# EAGLE schematic pj13_duplicate (EAGLE 7.3.2)
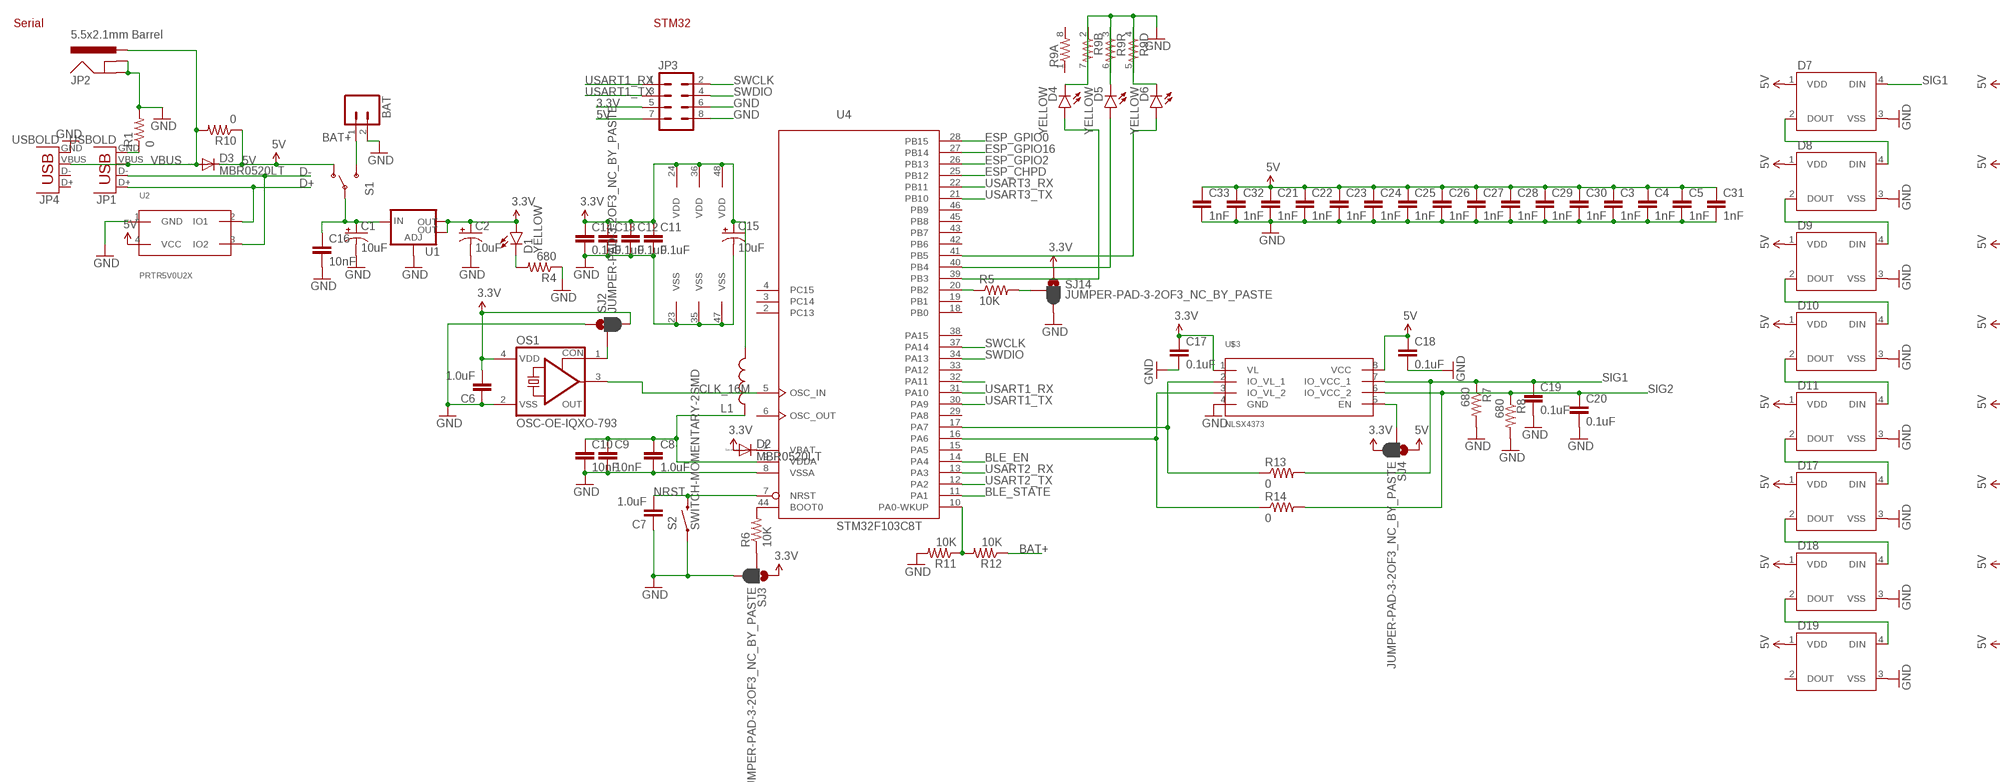
[diagram p0: schematic, sheet 1, part 1 of 2]
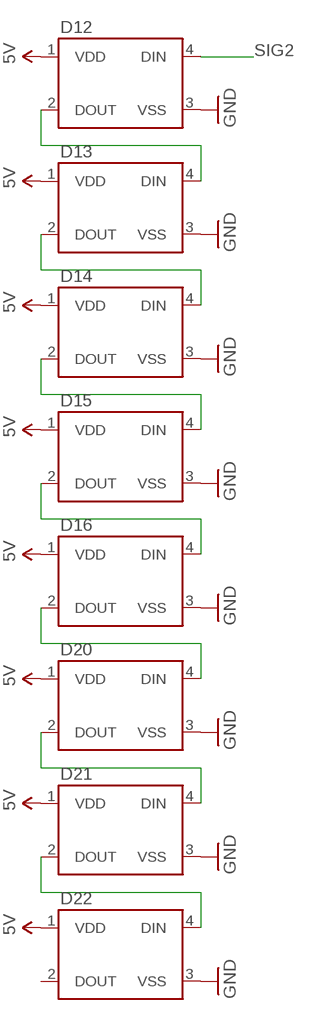
[diagram p1: schematic, sheet 1, part 2 of 2]

## Parts
BAT  M02LOCK  [1X02_LOCK]
C1  10uF  10UF-16V-10%(TANT)  [EIA3216]
C2  10uF  10UF-16V-10%(TANT)  [EIA3216]
C3  1nF  0.1UF-25V-5%(0603)  [0603-CAP]
C4  1nF  0.1UF-25V-5%(0603)  [0603-CAP]
C5  1nF  0.1UF-25V-5%(0603)  [0603-CAP]
C6  1.0uF  1.0UF-16V-10%(0603)  [0603-CAP]
C7  1.0uF  1.0UF-16V-10%(0603)  [0603-CAP]
C8  1.0uF  1.0UF-16V-10%(0603)  [0603-CAP]
C9  10nF  10NF/10000PF-50V-10%(0603)  [0603-CAP]
C10  10nF  10NF/10000PF-50V-10%(0603)  [0603-CAP]
C11  0.1uF  0.1UF-25V-5%(0603)  [0603-CAP]
C12  0.1uF  0.1UF-25V-5%(0603)  [0603-CAP]
C13  0.1uF  0.1UF-25V-5%(0603)  [0603-CAP]
C14  0.1uF  0.1UF-25V-5%(0603)  [0603-CAP]
C15  10uF  10UF-16V-10%(TANT)  [EIA3216]
C16  10nF  10NF/10000PF-50V-10%(0603)  [0603-CAP]
C17  0.1uF  0.1UF-25V-5%(0603)  [0603-CAP]
C18  0.1uF  0.1UF-25V-5%(0603)  [0603-CAP]
C19  0.1uF  0.1UF-25V-5%(0603)  [0603-CAP]
C20  0.1uF  0.1UF-25V-5%(0603)  [0603-CAP]
C21  1nF  0.1UF-25V-5%(0603)  [0603-CAP]
C22  1nF  0.1UF-25V-5%(0603)  [0603-CAP]
C23  1nF  0.1UF-25V-5%(0603)  [0603-CAP]
C24  1nF  0.1UF-25V-5%(0603)  [0603-CAP]
C25  1nF  0.1UF-25V-5%(0603)  [0603-CAP]
C26  1nF  0.1UF-25V-5%(0603)  [0603-CAP]
C27  1nF  0.1UF-25V-5%(0603)  [0603-CAP]
C28  1nF  0.1UF-25V-5%(0603)  [0603-CAP]
C29  1nF  0.1UF-25V-5%(0603)  [0603-CAP]
C30  1nF  0.1UF-25V-5%(0603)  [0603-CAP]
C31  1nF  0.1UF-25V-5%(0603)  [0603-CAP]
C32  1nF  0.1UF-25V-5%(0603)  [0603-CAP]
C33  1nF  0.1UF-25V-5%(0603)  [0603-CAP]
D1  YELLOW  LED-YELLOW1206  [LED-1206]
D2  MBR0520LT  [SOD123]
D3  MBR0520LT  [SOD123]
D4  YELLOW  LED-YELLOW1206  [LED-1206]
D5  YELLOW  LED-YELLOW1206  [LED-1206]
D6  YELLOW  LED-YELLOW1206  [LED-1206]
D7  WS2812B  [WS2812B]
D8  WS2812B  [WS2812B]
D9  WS2812B  [WS2812B]
D10  WS2812B  [WS2812B]
D11  WS2812B  [WS2812B]
D12  WS2812B  [WS2812B]
D13  WS2812B  [WS2812B]
D14  WS2812B  [WS2812B]
D15  WS2812B  [WS2812B]
D16  WS2812B  [WS2812B]
D17  WS2812B  [WS2812B]
D18  WS2812B  [WS2812B]
D19  WS2812B  [WS2812B]
D20  WS2812B  [WS2812B]
D21  WS2812B  [WS2812B]
D22  WS2812B  [WS2812B]
JP1  USBOLD  [USB-MINIB-OLD]
JP2  5.5x2.1mm Barrel  POWER_JACKSMD  [POWER_JACK_SMD]
JP3  M04X2SMD  [2X4_SMD]
JP4  USBOLD  [USB-MINIB-OLD]
L1  INDUCTOR0603  [0603]
OS1  OSC-OE-IQXO-793  [2.5X2-4-PAD]
R1  0  0OHM-1/10W-5%(0603)  [0603]
R4  680  680OHM1/10W5%(0603)  [0603-RES]
R5  10K  10KOHM-1/10W-1%(0603)0603  [0603-RES]
R6  10K  10KOHM-1/10W-1%(0603)0603  [0603-RES]
R7  680  680OHM1/10W5%(0603)  [0603-RES]
R8  680  680OHM1/10W5%(0603)  [0603-RES]
R9  RESISTOR-ARRAY0603-ARV  [0603-ARV]
R10  0  0OHM-1/10W-5%(0603)  [0603]
R11  10K  10KOHM-1/10W-1%(0603)0603  [0603-RES]
R12  10K  10KOHM-1/10W-1%(0603)0603  [0603-RES]
R13  0  680OHM1/10W5%(0603)  [0603-RES]
R14  0  680OHM1/10W5%(0603)  [0603-RES]
S1  SWITCH-SPDTSMD  [AYZ0202]
S2  SWITCH-MOMENTARY-2SMD  [TACTILE-SWITCH-SMD]
SJ2  JUMPER-PAD-3-2OF3_NC_BY_PASTE  [PAD-JUMPER-3-2OF3_NC_BY_PASTE_YES_SILK_FULL_BOX]
SJ3  JUMPER-PAD-3-2OF3_NC_BY_PASTE  [PAD-JUMPER-3-2OF3_NC_BY_PASTE_YES_SILK_FULL_BOX]
SJ4  JUMPER-PAD-3-2OF3_NC_BY_PASTE  [PAD-JUMPER-3-2OF3_NC_BY_PASTE_YES_SILK_FULL_BOX]
SJ14  JUMPER-PAD-3-2OF3_NC_BY_PASTE  [PAD-JUMPER-3-2OF3_NC_BY_PASTE_YES_SILK_FULL_BOX]
U1  V_REG_LM1117SOT223  [SOT223]
U2  PRTR5V0U2X  [SOT143]
U4  STM32F103C8T  [LQFP48]
U$3  NLSX4373  [SO08]

## Nets
3.3V: C2.A(+) C6.2 C11.1 C12.1 C13.1 C14.1 C15.A(+) C17.1 D1.A D2.A JP3.5 L1.2 OS1.4(VDD) SJ2.3 SJ3.1 SJ4.3 SJ14.1 U1.2(OUT) U1.4(OUT) U4.24(VDD) U4.36(VDD) U4.48(VDD) U$3.1(VL)
5V: C3.1 C4.1 C5.1 C18.1 C21.1 C22.1 C23.1 C24.1 C25.1 C26.1 C27.1 C28.1 C29.1 C30.1 C31.1 C32.1 C33.1 D3.C D7.1(VDD) D8.1(VDD) D9.1(VDD) D10.1(VDD) D11.1(VDD) D12.1(VDD) D13.1(VDD) D14.1(VDD) D15.1(VDD) D16.1(VDD) D17.1(VDD) D18.1(VDD) D19.1(VDD) D20.1(VDD) D21.1(VDD) D22.1(VDD) JP3.7 R10.1 S1.1(O) SJ4.1 U2.4(VCC) U$3.8(VCC)
BAT+: BAT.1 R12.1 S1.3(S)
BLE_EN: U4.14(PA4)
BLE_STATE: U4.11(PA1)
CLK_16M: OS1.3(OUT) U4.5(OSC_IN)
D+: JP1.D+ U2.2(IO1)
D-: JP1.D- U2.3(IO2)
ESP_CHPD: U4.25(PB12)
ESP_GPIO0: U4.28(PB15)
ESP_GPIO2: U4.26(PB13)
ESP_GPIO16: U4.27(PB14)
GND: BAT.2 C1.C(-) C2.C(-) C3.2 C4.2 C5.2 C6.1 C7.1 C8.2 C9.2 C10.2 C11.2 C12.2 C13.2 C14.2 C15.C(-) C16.2 C17.2 C18.2 C19.2 C20.2 C21.2 C22.2 C23.2 C24.2 C25.2 C26.2 C27.2 C28.2 C29.2 C30.2 C31.2 C32.2 C33.2 D7.3(VSS) D8.3(VSS) D9.3(VSS) D10.3(VSS) D11.3(VSS) D12.3(VSS) D13.3(VSS) D14.3(VSS) D15.3(VSS) D16.3(VSS) D17.3(VSS) D18.3(VSS) D19.3(VSS) D20.3(VSS) D21.3(VSS) D22.3(VSS) JP2.GND(GNDBREAK) JP2.P$4(GND) JP3.6 JP3.8 JP4.GND OS1.2(VSS) R1.2 R4.1 R7.2 R8.2 R9.5 R9.6 R9.7 R11.2 S2.1 SJ2.1 SJ3.3 SJ14.3 U1.1(ADJ) U2.1(GND) U4.8(VSSA) U4.23(VSS) U4.35(VSS) U4.47(VSS) U$3.4(GND)
N$1: JP1.GND R1.1
N$2: D11.2(DOUT) D17.4(DIN)
N$3: D1.C R4.2
N$4: D2.C U4.1(VBAT)
N$5: R11.1 R12.2 U4.10(PA0-WKUP)
N$6: C8.1 C9.1 C10.1 L1.1 U4.9(VDDA)
N$7: R6.2 U4.44(BOOT0)
N$8: D6.A U4.41(PB5)
N$9: R6.1 SJ3.2
N$10: D17.2(DOUT) D18.4(DIN)
N$11: OS1.1(CON) SJ2.2
N$13: D5.A U4.40(PB4)
N$14: SJ4.2 U$3.5(EN)
N$15: D18.2(DOUT) D19.4(DIN)
N$16: D4.A U4.39(PB3)
N$17: D4.C R9.2
N$18: D5.C R9.3
N$19: D6.C R9.4
N$20: C1.A(+) C16.1 S1.2(P) U1.3(IN)
N$24: D12.2(DOUT) D13.4(DIN)
N$25: D13.2(DOUT) D14.4(DIN)
N$26: R13.1 U4.17(PA7) U$3.2(IO_VL_1)
N$27: R14.1 U4.16(PA6) U$3.3(IO_VL_2)
N$28: D7.2(DOUT) D8.4(DIN)
N$29: D8.2(DOUT) D9.4(DIN)
N$30: D9.2(DOUT) D10.4(DIN)
N$31: D10.2(DOUT) D11.4(DIN)
N$32: D14.2(DOUT) D15.4(DIN)
N$33: D15.2(DOUT) D16.4(DIN)
N$34: D16.2(DOUT) D20.4(DIN)
N$35: D20.2(DOUT) D21.4(DIN)
N$36: D21.2(DOUT) D22.4(DIN)
N$48: R5.2 SJ14.2
NRF_CSN: U4.32(PA11)
NRST: C7.2 S2.3 U4.7(NRST)
OURET: R5.1 U4.20(PB2)
SIG1: C19.1 D7.4(DIN) R7.1 R13.2 U$3.7(IO_VCC_1)
SIG2: C20.1 D12.4(DIN) R8.1 R14.2 U$3.6(IO_VCC_2)
SWCLK: JP3.2 U4.37(PA14)
SWDIO: JP3.4 U4.34(PA13)
USART1_RX: JP3.1 U4.31(PA10)
USART1_TX: JP3.3 U4.30(PA9)
USART2_RX: U4.13(PA3)
USART2_TX: U4.12(PA2)
USART3_RX: U4.22(PB11)
USART3_TX: U4.21(PB10)
VBUS: D3.A JP1.VBUS JP2.VIN0(PWR) JP4.VBUS R10.2
Unconnected: D19.2(DOUT) D22.2(DOUT) JP4.D+ JP4.D- R9.1 R9.8 U4.2(PC13) U4.3(PC14) U4.4(PC15) U4.6(OSC_OUT) U4.15(PA5) U4.18(PB0) U4.19(PB1) U4.29(PA8) U4.33(PA12) U4.38(PA15) U4.42(PB6) U4.43(PB7) U4.45(PB8) U4.46(PB9)

## Notes on the sheet
- Serial | STM32

## Library data of the parts
BAT = SparkFun-Connectors:M02: Standard 2-pin 0.1" header. Use with - straight break away headers ( PRT-00116) - right angle break away headers (PRT-00553) - swiss pins (PRT-00743) - machine pins (PRT-00117) - female headers (PRT-00115) Molex polarized connector foot print use with: PRT-08233 with associated crimp pins and housings. 2.54_SCREWTERM for use with PRT-10571. 3.5mm Screw Terminal footprints for PRT-08084 5mm Screw Terminal footprints for use with PRT-08432
C1 C2 C15 = SparkFun-Capacitors:10UF-16V-10%(TANT): CAP-00811 1206/EIA-3216 Tantalum capacitor; PROD_ID: CAP-00811
C3-C5 C21-C33 = SparkFun-Capacitors:0.1UF-25V-5%(0603): CAP-08604; PROD_ID: CAP-08604; VALUE: 0.1uF
C6-C8 = SparkFun-Capacitors:1.0UF-16V-10%(0603): CAP-00868; PROD_ID: CAP-00868
C9 C10 C16 = SparkFun-Capacitors:10NF/10000PF-50V-10%(0603): CAP-00867; PROD_ID: CAP-00867
C11-C14 C17-C20 = SparkFun-Capacitors:0.1UF-25V-5%(0603): CAP-08604; PROD_ID: CAP-08604
D1 D4-D6 = SparkFun-LED:LED-YELLOW: Yellow SMD LEDs LilyPad 1206- DIO-09909 0603- DIO-09003 "SMART" means more efficient and expensive; PROD_ID: DIO-00820
D2 D3 = diode:MBR0520LT: SCHOTTKY BARRIER RECTIFIER Source: http://onsemi.com .. MBR0520LT1-D.pdf
D7-D22 = SparkFun-LED:WS2812B: WS2812B - Intelligent control LED integrated light source Technical Specifications: Power Supply Voltage (VDD): 3.5 to 5.3 V Input Voltage (VI): -0.5 to VDD+0.5 V Operating Junction Temperature (Topt): -25°C to +80°C Storage Temperature Range (Tstg): -55°C to +150°C; PROD_ID: DIO-12503
JP1 JP4 = SparkFun-Connectors:USB: USB Connectors USB-B-PTH is fully proven SKU : PRT-00139/CONN-08278 USB-miniB is fully proven SKU : PRT-00587 USB-A-PCB is untested. USB-A-H is throughly reviewed, but untested. Spark Fun Electronics SKU : PRT-00437 USB-B-SMT is throughly reviewed, but untested. Needs silkscreen touching up. USB-A-S has not been used/tested USB-MB-H has not been used/tested USB-MICROB has been used. CONN-09505
JP2 = SparkFun-Connectors:POWER_JACK: Power Jack This is the standard 5.5mm barrel jack for power. The PTH is the most common, proven, reliable, footprint. The Slot footprint only works if the mill layer is transmitted to the PCB fab house so be warned. Mating wall wart : TOL-00298 (and others); PROD_ID: CONN-08106; SF_ID: PRT-12748
JP3 = SparkFun-Connectors:M04X2: .1" header, two rows of four.
L1 = SparkFun-Passives:INDUCTOR: Inductors Basic Inductor/Choke - 0603 and 1206. Footprints are not proven and vary greatly between part numbers. INDUCTOR POWER 3.3UH 4.0A SMD 0.197" L x 0.197" W x 0.177" H (5.00mm x 5.00mm x 4.50mm)
OS1 = IQD-Frequency-Products:OSC-OE: OSCILLATOR WITH OE
R1 R10 = SparkFun-Resistors:0OHM-1/10W-5%(0603): RES-08609; PROD_ID: RES-08609
R4 R7 R8 = SparkFun-Resistors:680OHM1/10W5%(0603): RES-09333; PROD_ID: RES-09333
R5 R6 R11 R12 = SparkFun-Resistors:10KOHM-1/10W-1%(0603): RES-00824; PROD_ID: RES-00824
R9 = SparkFun-Resistors:RESISTOR-ARRAY: Array Chip Resistor Source: RS Component / Phycomp
R13 R14 = SparkFun-Resistors:680OHM1/10W5%(0603): RES-09333; PROD_ID: RES-09333; VALUE: 680
S1 = SparkFun-Electromechanical:SWITCH-SPDT: SPDT Switch Simple slide switch, Spark Fun Electronics SKU : COM-00102 DPDT SMT slide switch, AYZ0202, SWCH-08179; PROD_ID: SWCH-08179; SF_ID: COM-00597
S2 = SparkFun-Electromechanical:SWITCH-MOMENTARY-2: Various NO switches- pushbuttons, reed, etc; PROD_ID: SWCH-08247
SJ2-SJ4 SJ14 = SparkFun-Passives:JUMPER-PAD-3-2OF3_NC_BY_PASTE
U1 = SparkFun-PowerIC:V_REG_LM1117: Voltage Regulator LM1117 Standard adjustable voltage regulator but in SMD form. Spark Fun Electronics SKU : COM-00595; PROD_ID: VREG-08170
U2 = semicon-smd-ipc:PRTR5V0U2X
U4 = micro-stm_v3:STM32F103C*T: ARM 32-bit Cortex™-M3 CPU 72 MHz maximum frequency 16 to 128 Kbytes of Flash memory 6 to 20 kbytes of SRAM 37 GPIOs 2.0 to 3.6 V application supply
U$3 = SparkFun-DigitalIC:NLSX4373